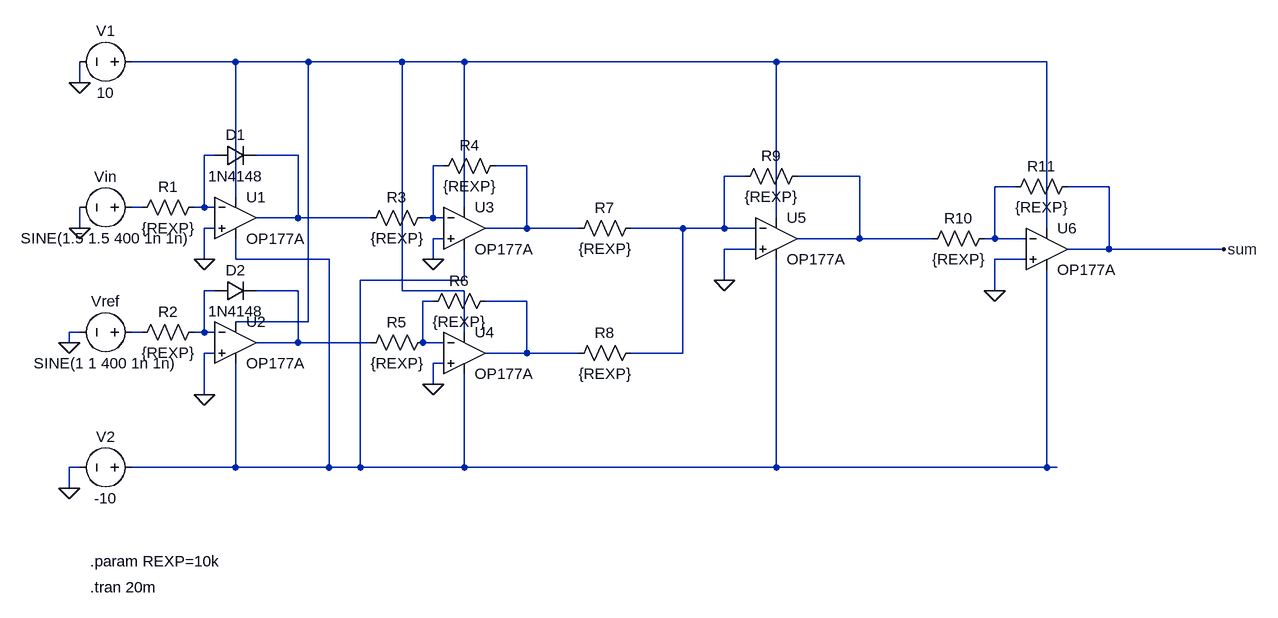
[diagram p0: schematic logsum.asc]
logsum.asc, the LTspice schematic file:
Version 4.1
SHEET 1 3688 712
WIRE 272 -112 112 -112
WIRE 384 -112 272 -112
WIRE 528 -112 384 -112
WIRE 624 -112 528 -112
WIRE 1104 -112 624 -112
WIRE 1520 -112 1104 -112
WIRE 32 -80 32 -112
WIRE 240 32 224 32
WIRE 368 32 304 32
WIRE 592 48 576 48
WIRE 720 48 672 48
WIRE 1056 64 1024 64
WIRE 1232 64 1136 64
WIRE 1472 80 1440 80
WIRE 1616 80 1552 80
WIRE 272 96 272 -112
WIRE 128 112 112 112
WIRE 224 112 224 32
WIRE 224 112 208 112
WIRE 240 112 224 112
WIRE 624 112 624 -112
WIRE 368 128 368 32
WIRE 368 128 304 128
WIRE 480 128 368 128
WIRE 576 128 576 48
WIRE 576 128 560 128
WIRE 592 128 576 128
WIRE 1104 128 1104 -112
WIRE 32 144 32 112
WIRE 240 144 224 144
WIRE 720 144 720 48
WIRE 720 144 656 144
WIRE 800 144 720 144
WIRE 960 144 880 144
WIRE 1024 144 1024 64
WIRE 1024 144 960 144
WIRE 1072 144 1024 144
WIRE 1520 144 1520 -112
WIRE 592 160 576 160
WIRE 1232 160 1232 64
WIRE 1232 160 1136 160
WIRE 1344 160 1232 160
WIRE 1440 160 1440 80
WIRE 1440 160 1424 160
WIRE 1488 160 1440 160
WIRE 1072 176 1024 176
WIRE 1616 176 1616 80
WIRE 1616 176 1552 176
WIRE 1792 176 1616 176
WIRE 224 192 224 144
WIRE 272 192 272 160
WIRE 416 192 272 192
WIRE 576 192 576 160
WIRE 1488 192 1440 192
WIRE 624 224 624 176
WIRE 624 224 464 224
WIRE 1024 224 1024 176
WIRE 240 240 224 240
WIRE 368 240 304 240
WIRE 528 240 528 -112
WIRE 624 240 528 240
WIRE 1440 240 1440 192
WIRE 576 256 560 256
WIRE 720 256 656 256
WIRE 384 288 384 -112
WIRE 384 288 272 288
WIRE 32 304 16 304
WIRE 128 304 112 304
WIRE 224 304 224 240
WIRE 224 304 208 304
WIRE 240 304 224 304
WIRE 624 304 624 240
WIRE 16 320 16 304
WIRE 368 320 368 240
WIRE 368 320 304 320
WIRE 480 320 368 320
WIRE 560 320 560 256
WIRE 592 320 560 320
WIRE 240 336 224 336
WIRE 720 336 720 256
WIRE 720 336 656 336
WIRE 800 336 720 336
WIRE 960 336 960 144
WIRE 960 336 880 336
WIRE 592 352 576 352
WIRE 576 384 576 352
WIRE 224 400 224 336
WIRE 32 512 16 512
WIRE 272 512 272 352
WIRE 272 512 112 512
WIRE 416 512 416 192
WIRE 416 512 272 512
WIRE 464 512 464 224
WIRE 464 512 416 512
WIRE 624 512 624 368
WIRE 624 512 464 512
WIRE 1104 512 1104 192
WIRE 1104 512 624 512
WIRE 1520 512 1520 208
WIRE 1520 512 1104 512
WIRE 1536 512 1520 512
WIRE 16 544 16 512
FLAG 32 144 0
FLAG 224 192 0
FLAG 16 320 0
FLAG 224 400 0
FLAG 576 192 0
FLAG 576 384 0
FLAG 32 -80 0
FLAG 16 544 0
FLAG 1024 224 0
FLAG 1440 240 0
FLAG 1792 176 sum
SYMBOL voltage 128 112 R90
WINDOW 0 -32 56 VBottom 2
WINDOW 3 32 56 VTop 2
WINDOW 123 0 0 Left 0
WINDOW 39 0 0 Left 0
SYMATTR InstName Vin
SYMATTR Value SINE(1.5 1.5 400 1n 1n)
SYMBOL OpAmps\\OP177A 272 64 R0
SYMATTR InstName U1
SYMBOL res 224 96 R90
WINDOW 0 0 56 VBottom 2
WINDOW 3 32 56 VTop 2
SYMATTR InstName R1
SYMATTR Value {REXP}
SYMBOL diode 240 48 R270
WINDOW 0 32 32 VTop 2
WINDOW 3 0 32 VBottom 2
SYMATTR InstName D1
SYMATTR Value 1N4148
SYMBOL OpAmps\\OP177A 272 256 R0
SYMATTR InstName U2
SYMBOL voltage 128 304 R90
WINDOW 0 -32 56 VBottom 2
WINDOW 3 32 56 VTop 2
WINDOW 123 0 0 Left 0
WINDOW 39 0 0 Left 0
SYMATTR InstName Vref
SYMATTR Value SINE(1 1 400 1n 1n)
SYMBOL res 224 288 R90
WINDOW 0 0 56 VBottom 2
WINDOW 3 32 56 VTop 2
SYMATTR InstName R2
SYMATTR Value {REXP}
SYMBOL diode 240 256 R270
WINDOW 0 32 32 VTop 2
WINDOW 3 0 32 VBottom 2
SYMATTR InstName D2
SYMATTR Value 1N4148
SYMBOL OpAmps\\OP177A 624 80 R0
SYMATTR InstName U3
SYMBOL res 576 112 R90
WINDOW 0 0 56 VBottom 2
WINDOW 3 32 56 VTop 2
SYMATTR InstName R3
SYMATTR Value {REXP}
SYMBOL res 688 32 R90
WINDOW 0 0 56 VBottom 2
WINDOW 3 32 56 VTop 2
SYMATTR InstName R4
SYMATTR Value {REXP}
SYMBOL OpAmps\\OP177A 624 272 R0
SYMATTR InstName U4
SYMBOL res 576 304 R90
WINDOW 0 0 56 VBottom 2
WINDOW 3 32 56 VTop 2
SYMATTR InstName R5
SYMATTR Value {REXP}
SYMBOL res 672 240 R90
WINDOW 0 0 56 VBottom 2
WINDOW 3 32 56 VTop 2
SYMATTR InstName R6
SYMATTR Value {REXP}
SYMBOL voltage 128 -112 R90
WINDOW 0 -32 56 VBottom 2
WINDOW 3 32 56 VTop 2
WINDOW 123 0 0 Left 0
WINDOW 39 0 0 Left 0
SYMATTR InstName V1
SYMATTR Value 10
SYMBOL voltage 128 512 R90
WINDOW 0 -32 56 VBottom 2
WINDOW 3 32 56 VTop 2
WINDOW 123 0 0 Left 0
WINDOW 39 0 0 Left 0
SYMATTR InstName V2
SYMATTR Value -10
SYMBOL res 896 128 R90
WINDOW 0 0 56 VBottom 2
WINDOW 3 32 56 VTop 2
SYMATTR InstName R7
SYMATTR Value {REXP}
SYMBOL res 896 320 R90
WINDOW 0 0 56 VBottom 2
WINDOW 3 32 56 VTop 2
SYMATTR InstName R8
SYMATTR Value {REXP}
SYMBOL OpAmps\\OP177A 1104 96 R0
SYMATTR InstName U5
SYMBOL res 1152 48 R90
WINDOW 0 0 56 VBottom 2
WINDOW 3 32 56 VTop 2
SYMATTR InstName R9
SYMATTR Value {REXP}
SYMBOL res 1440 144 R90
WINDOW 0 0 56 VBottom 2
WINDOW 3 32 56 VTop 2
SYMATTR InstName R10
SYMATTR Value {REXP}
SYMBOL OpAmps\\OP177A 1520 112 R0
SYMATTR InstName U6
SYMBOL res 1568 64 R90
WINDOW 0 0 56 VBottom 2
WINDOW 3 32 56 VTop 2
SYMATTR InstName R11
SYMATTR Value {REXP}
TEXT 48 656 Left 2 !.param REXP=10k
TEXT 48 696 Left 2 !.tran 20m

The netlist it stands for:
* logsum.asc
Vin N009 0 SINE(1.5 1.5 400 1n 1n)
X§U1 0 N002 N001 N010 N003 OP177A  ; pins In+ In- V+ V- OUT
R1 N002 N009 {REXP}
D1 N002 N003 1N4148
X§U2 0 N011 N001 N010 N012 OP177A  ; pins In+ In- V+ V- OUT
Vref N015 0 SINE(1 1 400 1n 1n)
R2 N011 N015 {REXP}
D2 N011 N012 1N4148
X§U3 0 N004 N001 N010 N005 OP177A  ; pins In+ In- V+ V- OUT
R3 N004 N003 {REXP}
R4 N005 N004 {REXP}
X§U4 0 N013 N001 N010 N014 OP177A  ; pins In+ In- V+ V- OUT
R5 N013 N012 {REXP}
R6 N014 N013 {REXP}
V1 N001 0 10
V2 N010 0 -10
R7 N006 N005 {REXP}
R8 N006 N014 {REXP}
X§U5 0 N006 N001 N010 N007 OP177A  ; pins In+ In- V+ V- OUT
R9 N007 N006 {REXP}
R10 N008 N007 {REXP}
X§U6 0 N008 N001 N010 sum OP177A  ; pins In+ In- V+ V- OUT
R11 sum N008 {REXP}
.model D D
.lib standard.dio
.param REXP=10k
.tran 20m
.backanno
.end